# Altium schematic sheet 14 TPU.SchDoc
size A2; ApprovedBy: DNP; CheckedBy: DNP; Author: DNP; CompanyName: Google LLC; DrawnBy: DNP; Organization: Google LLC; Address1: 1600 Amphitheatre Parkway; Address2: Mountain View, CA 94043; Address3: DNP; Address4: DNP; DocumentNumber: 14; SheetNumber: 14; SheetTotal: 17; VersionControl_RevNumber: DNP; IsUserConfigurable: DNP; Time: DNP; ImagePath: DNP; Rule: DNP; ProjectName: Enterprise; Application_BuildNumber: DNP
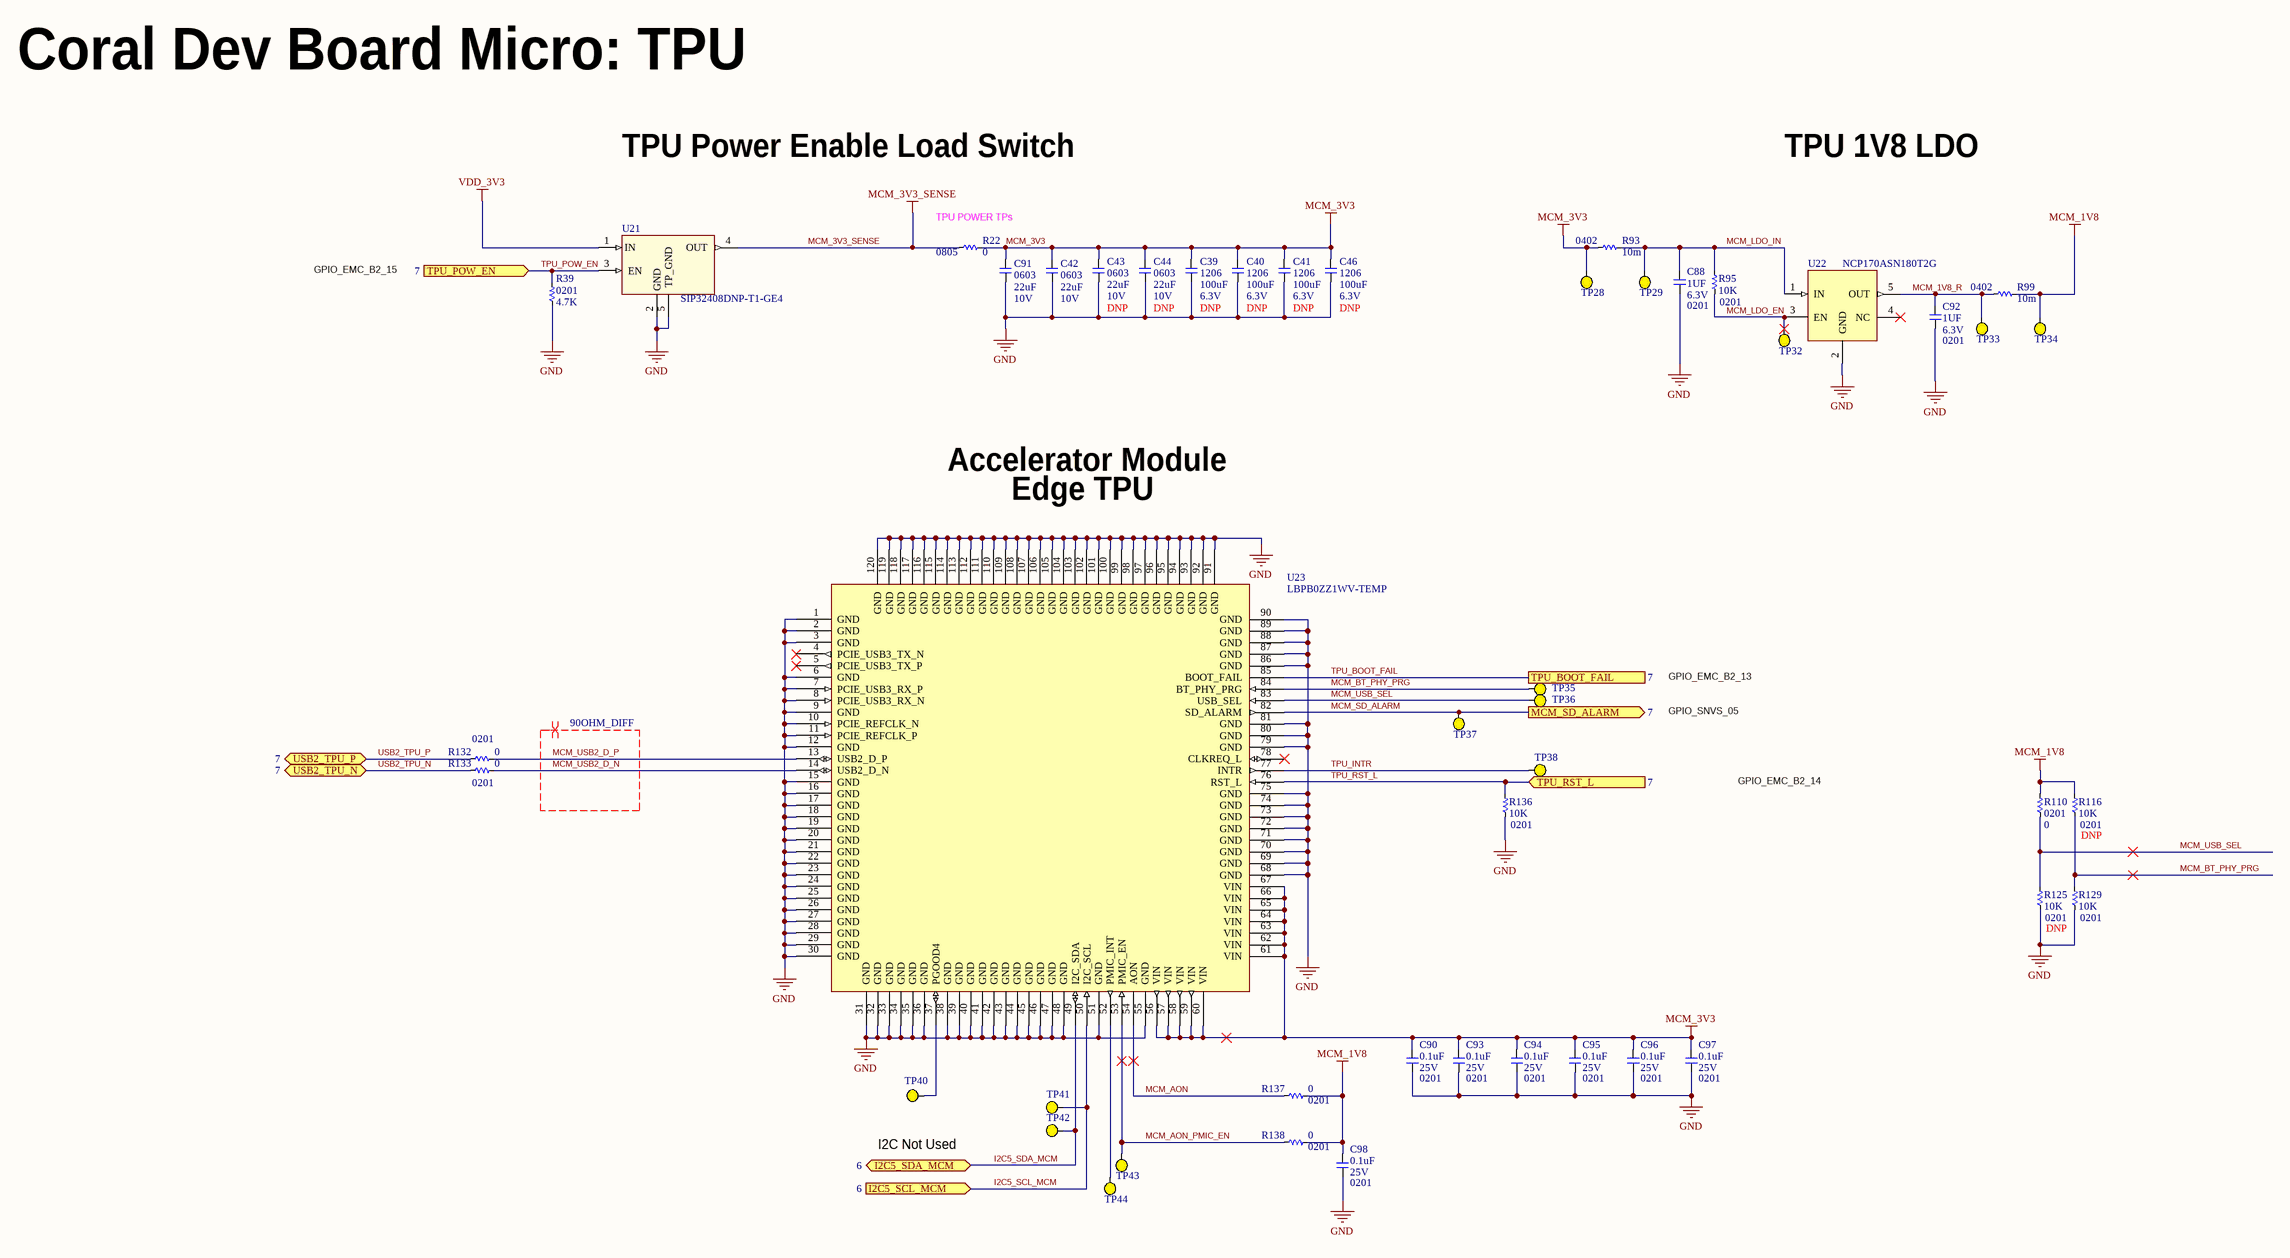
[diagram p0: 14 TPU.SchDoc]

## Parts
C39  value 100uF  Package: 1206  Voltage: 6.3V  [C1206Y_1.90MM]  (hidden comment: __Template_Cap)
C40  value 100uF  Package: 1206  Voltage: 6.3V  [C1206Y_1.90MM]  (hidden comment: __Template_Cap)
C41  value 100uF  Package: 1206  Voltage: 6.3V  [C1206Y_1.90MM]  (hidden comment: __Template_Cap)
C42  value 22uF  Package: 0603  Voltage: 10V  [C0603]  (hidden comment: __Template_Cap)
C43  value 22uF  Package: 0603  Voltage: 10V  [C0603]  (hidden comment: __Template_Cap)
C44  value 22uF  Package: 0603  Voltage: 10V  [C0603]  (hidden comment: __Template_Cap)
C46  value 100uF  Package: 1206  Voltage: 6.3V  [C1206Y_1.90MM]  (hidden comment: __Template_Cap)
C88  value 1UF  Package: 0201  Voltage: 6.3V  [C0201_H0.39MM]  (hidden comment: __Template_Cap)
C90  value 0.1uF  Package: 0201  Voltage: 25V  [C0201Y]  (hidden comment: __Template_Cap)
C91  value 22uF  Package: 0603  Voltage: 10V  [C0603]  (hidden comment: __Template_Cap)
C92  value 1UF  Package: 0201  Voltage: 6.3V  [C0201_H0.39MM]  (hidden comment: __Template_Cap)
C93  value 0.1uF  Package: 0201  Voltage: 25V  [C0201Y]  (hidden comment: __Template_Cap)
C94  value 0.1uF  Package: 0201  Voltage: 25V  [C0201Y]  (hidden comment: __Template_Cap)
C95  value 0.1uF  Package: 0201  Voltage: 25V  [C0201Y]  (hidden comment: __Template_Cap)
C96  value 0.1uF  Package: 0201  Voltage: 25V  [C0201Y]  (hidden comment: __Template_Cap)
C97  value 0.1uF  Package: 0201  Voltage: 25V  [C0201Y]  (hidden comment: __Template_Cap)
C98  value 0.1uF  Package: 0201  Voltage: 25V  [C0201Y]  (hidden comment: __Template_Cap)
R22  value 0  Package: 0805  [R0805]
R39  value 4.7K  Package: 0201  [R0201]
R93  value 10m  Package: 0402  [R0402]
R95  value 10K  Package: 0201  [R0201]
R99  value 10m  Package: 0402  [R0402]
R110  value 0  Package: 0201  [R0201]
R116  value 10K  Package: 0201  [R0201]
R125  value 10K  Package: 0201  [R0201]
R129  value 10K  Package: 0201  [R0201]
R132  value 0  Package: 0201  [R0201]
R133  value 0  Package: 0201  [R0201]
R136  value 10K  Package: 0201  [R0201]
R137  value 0  Package: 0201  [R0201]
R138  value 0  Package: 0201  [R0201]
TP28  TESTPAD_25MIL  [TESTPAD_SMT_25MIL]  (value not drawn)  (no BOM)
TP29  TESTPAD_25MIL  [TESTPAD_SMT_25MIL]  (value not drawn)  (no BOM)
TP32  TESTPAD_25MIL  [TESTPAD_SMT_25MIL]  (value not drawn)  (no BOM)
TP33  TESTPAD_25MIL  [TESTPAD_SMT_25MIL]  (value not drawn)  (no BOM)
TP34  TESTPAD_25MIL  [TESTPAD_SMT_25MIL]  (value not drawn)  (no BOM)
TP35  TESTPAD_25MIL  [TESTPAD_SMT_25MIL]  (value not drawn)  (no BOM)
TP36  TESTPAD_25MIL  [TESTPAD_SMT_25MIL]  (value not drawn)  (no BOM)
TP37  TESTPAD_25MIL  [TESTPAD_SMT_25MIL]  (value not drawn)  (no BOM)
TP38  TESTPAD_25MIL  [TESTPAD_SMT_25MIL]  (value not drawn)  (no BOM)
TP40  TESTPAD_25MIL  [TESTPAD_SMT_25MIL]  (value not drawn)  (no BOM)
TP41  TESTPAD_25MIL  [TESTPAD_SMT_25MIL]  (value not drawn)  (no BOM)
TP42  TESTPAD_25MIL  [TESTPAD_SMT_25MIL]  (value not drawn)  (no BOM)
TP43  TESTPAD_25MIL  [TESTPAD_SMT_25MIL]  (value not drawn)  (no BOM)
TP44  TESTPAD_25MIL  [TESTPAD_SMT_25MIL]  (value not drawn)  (no BOM)
U21  MFG P/N: SIP32408DNP-T1-GE4  [TDFN120X160X60-4-TP]  (hidden comment: SWITCH_SIP32408DNP-T1-GE4)
U22  MFG P/N: NCP170ASN180T2G  [TSOP95P275X110-5]  (hidden comment: LDO_NCP170ASN180T2G)
U23  LBPB0ZZ1WV-TEMP  [QFN120_0P5_10X15]

## Ports
I2C5_SCL_MCM (in, see 6), I2C5_SDA_MCM (bidir, see 6), MCM_SD_ALARM (out, see 7), TPU_BOOT_FAIL (see 7), TPU_POW_EN (in, see 7), TPU_RST_L (in, see 7), USB2_TPU_N (bidir, see 7), USB2_TPU_P (bidir, see 7)

## Nets
GND: C39.2 C40.2 C41.2 C42.2 C43.2 C44.2 C46.2 C88.2 C90.2 C91.2 C92.2 C93.2 C94.2 C95.2 C96.2 C97.2 C98.2 R39.1 R125.1 R129.1 R136.1 U21.2(GND) U21.5(TP_GND) U22.2(GND) U23.1(GND) U23.2(GND) U23.3(GND) U23.6(GND) U23.7(PCIE_USB3_RX_P) U23.8(PCIE_USB3_RX_N) U23.9(GND) U23.10(PCIE_REFCLK_N) U23.11(PCIE_REFCLK_P) U23.12(GND) U23.15(GND) U23.16(GND) U23.17(GND) U23.18(GND) U23.19(GND) U23.20(GND) U23.21(GND) U23.22(GND) U23.23(GND) U23.24(GND) U23.25(GND) U23.26(GND) U23.27(GND) U23.28(GND) U23.29(GND) U23.30(GND) U23.31(GND) U23.32(GND) U23.33(GND) U23.34(GND) U23.35(GND) U23.36(GND) U23.38(GND) U23.39(GND) U23.40(GND) U23.41(GND) U23.42(GND) U23.43(GND) U23.44(GND) U23.45(GND) U23.46(GND) U23.47(GND) U23.48(GND) U23.51(GND) U23.55(GND) U23.68(GND) U23.69(GND) U23.70(GND) U23.71(GND) U23.72(GND) U23.73(GND) U23.74(GND) U23.75(GND) U23.79(GND) U23.80(GND) U23.81(GND) U23.86(GND) U23.87(GND) U23.88(GND) U23.89(GND) U23.90(GND) U23.91(GND) U23.92(GND) U23.93(GND) U23.94(GND) U23.95(GND) U23.96(GND) U23.97(GND) U23.98(GND) U23.99(GND) U23.100(GND) U23.101(GND) U23.102(GND) U23.103(GND) U23.104(GND) U23.105(GND) U23.106(GND) U23.107(GND) U23.108(GND) U23.109(GND) U23.110(GND) U23.111(GND) U23.112(GND) U23.113(GND) U23.114(GND) U23.115(GND) U23.116(GND) U23.117(GND) U23.118(GND) U23.119(GND) U23.120(GND)
MCM_1V8: C98.1 R99.2 R110.2 R116.2 R137.2 R138.2 TP34.1
MCM_3V3: C39.1 C40.1 C41.1 C42.1 C43.1 C44.1 C46.1 C90.1 C91.1 C93.1 C94.1 C95.1 C96.1 C97.1 R22.2 R93.1 TP28.1 U23.56(VIN) U23.57(VIN) U23.58(VIN) U23.59(VIN) U23.60(VIN) U23.61(VIN) U23.62(VIN) U23.63(VIN) U23.64(VIN) U23.65(VIN) U23.66(VIN) U23.67(VIN)
MCM_3V3_SENSE: R22.1 U21.4(OUT)
VDD_3V3: U21.1(IN)
I2C5_SCL_MCM: TP41.1 U23.50(I2C_SCL) ; port I2C5_SCL_MCM
I2C5_SDA_MCM: TP42.1 U23.49(I2C_SDA) ; port I2C5_SDA_MCM
MCM_1V8_R: C92.1 R99.1 TP33.1 U22.5(OUT)
MCM_AON: R137.1 U23.54(AON)
MCM_AON_PMIC_EN: R138.1 TP43.1 U23.53(PMIC_EN)
MCM_BT_PHY_PRG: R116.1 R129.2 TP35.1 U23.84(BT_PHY_PRG)
MCM_LDO_EN: R95.1 TP32.1 U22.3(EN)
MCM_LDO_IN: C88.1 R93.2 R95.2 TP29.1 U22.1(IN)
MCM_SD_ALARM: TP37.1 U23.82(SD_ALARM) ; port MCM_SD_ALARM
MCM_USB2_D_N: R133.2 U23.14(USB2_D_N)
MCM_USB2_D_P: R132.2 U23.13(USB2_D_P)
MCM_USB_SEL: R110.1 R125.2 TP36.1 U23.83(USB_SEL)
TPU_BOOT_FAIL: U23.85(BOOT_FAIL) ; port TPU_BOOT_FAIL
TPU_INTR: TP38.1 U23.77(INTR)
TPU_POW_EN: R39.2 U21.3(EN) ; port TPU_POW_EN
TPU_RST_L: R136.2 U23.76(RST_L) ; port TPU_RST_L
USB2_TPU_N: R133.1 ; port USB2_TPU_N
USB2_TPU_P: R132.1 ; port USB2_TPU_P
NetTP40_1: TP40.1 U23.37(PGOOD4)
NetTP44_1: TP44.1 U23.52(PMIC_INT)

Not connected (* = marked no-connect by the designer): U22 4(NC)*; U23 4(PCIE_USB3_TX_N)* 5(PCIE_USB3_TX_P)* 78(CLKREQ_L)*

## Layout directives
differential pair; differential pair class 90OHM_DIFF: MCM_USB2_D_N, MCM_USB2_D_P

## Notes on the sheet
- Coral Dev Board Micro: TPU
- TPU Power Enable Load Switch
- TPU 1V8 LDO
- GPIO_EMC_B2_15
- (near R22) TPU POWER TPs
- Accelerator Module
- Edge TPU
- GPIO_EMC_B2_13
- GPIO_SNVS_05
- GPIO_EMC_B2_14
- (near TP40) I2C Not Used
- Project:
- Engineer:
- Date:
- File:
- Revision:
- Sheet
- of

## Library data of the parts
C39-C41 C46 = 1051: CAP, CER, X5R, 100UF, 6.3V, 20%, 1206; ID: 1051; MFG: MURATA; MFG P/N: GRM31CR60J107ME39L; XPN: 150-00520-00; PROXY: 150-04679-00; Status: Obsolete; Dielectric: X5R; Tolerance: 20%; Height: 1.9mm T; ComponentLink1Description: Datasheet; COMMON: 150-00520-00; DNP: DNP
C42 C91 = 108: CAP, CER, X5R, 22uF, 20%, 10V, 0603; ID: 108; MFG: TDK; MFG P/N: C1608X5R1A226M080AC; XPN: 150-00202-00; PROXY: Use ID #452; Status: Released; Dielectric: X5R; Tolerance: 20%; Height: 1mm; ComponentLink1Description: Datasheet; COMMON: 150-00202-00
C43 C44 = 392: CAP, CER, X5R, 22uF, 20%, 10V, 0603; ID: 392; MFG: SAMSUNG; MFG P/N: CL10A226MP8NUNE; XPN: 150-00202-00; PROXY: Use ID #452; Status: Released; Dielectric: X5R; Tolerance: 20%; Height: 0.9mm T; ComponentLink1Description: Datasheet; COMMON: 150-00202-00; DNP: DNP
C88 C92 = 1771: CAP, CER, X6S, 1uF, 20%, 6.3V, 0201, 0.39mm; ID: 1771; MFG: MURATA; MFG P/N: GRM033C80J105ME05D; EPIC: G150-02531-00; Status: In Development; Dielectric: X6S; Tolerance: 20%; Height: 0.39mm; Supplier 1: Digi-Key; HelpURL: https://www.digikey.com/product-detail/en/murata-electronics-north-america/GRM033C80J105ME05D/490-13218-1-ND/5877426; ComponentLink1Description: Datasheet; ComponentLink1URL: https://psearch.en.murata.com/capacitor/product/GRM033C80J105ME05%23.pdf; Supplier Part Number 1: 490-13218-1-ND
C90 C93-C98 = 386: CAP, CER, X5R, 0.1uF, 25V, 20%, 0201, 0.33mm T; ID: 386; MFG: MURATA; MFG P/N: GRM033R61E104ME14D; XPN: 150-01204-00; Status: Released; Dielectric: X5R; Tolerance: 20%; Height: 0.33mm T; ComponentLink1Description: Datasheet; COMMON: 150-01204-00; LOON: 150-01204-00; Gecko: 150-01204-00
R22 = 7564: RES, 0, JUMPER, 1/8W, 0805; ID: 7564; MFG: YAGEO; MFG P/N: RC0805JR-070RL; Tolerance: 5%; COMMON: 470-00435-00; Gecko: 470-17928-00; Status: Released; Power: 1/8W; LOON: 470-00435-00; XPN: 470-00435-00
R39 = 6602: RES, 4.7K, 5%, 1/20W, 0201; ID: 6602; MFG: YAGEO; MFG P/N: RC0201JR-074K7L; COMMON: 470-00012-00; Status: Released; Power: 1/20W; Tolerance: 5%; LOON: 470-00012-00; Gecko: 470-00012-00; XPN: 470-00012-00
R93 R99 = 7159: RES, 0.01, 5%, 1/4W, 0402; ID: 7159; MFG: YAGEO; MFG P/N: PE0402JRF470R01L; COMMON: 470-02385-00; Status: Released; Power: 1/4W; Tolerance: 5%; LOON: 470-02385-00; Gecko: 470-02385-00; XPN: 470-02385-00
R95 R116 R125 R129 R136 = 4151: RES, 10K, 1%, 1/20W, 0201; ID: 4151; MFG: YAGEO; MFG P/N: RC0201FR-0710KL; COMMON: 470-00033-00; PROXY: 470-16076-00; Status: Released; Power: 1/20W; Tolerance: 1%; Height: 0.26mm; Supplier 1: Digi-Key; LOON: 470-00033-00; Gecko: 470-00033-00; XPN: 470-00033-00; Supplier Part Number 1: 311-10.0KMCT-ND
  R116 R125: DNP: DNP
R110 R132 R133 R137 R138 = 8315: RES, 0.0, 1/20W, 0201; ID: 8315; MFG: PANASONIC; MFG P/N: ERJ1GN0R00C; Tolerance: JUMPER; COMMON: 470-00013-00; PROXY: Use ID #6940; Status: Released; Power: 1/20W; LOON: 470-00013-00; Gecko: 470-00013-00; XPN: 470-00013-00
TP28 TP29 TP32-TP38 TP40-TP44 = 115: TESTPAD_SMT_25MIL; ID: 115; MFG: _PCB Feature; Status: In Development; ComponentLink1URL: _PCB Feature
U21 = 926: IC, SW, SIP32408, HIGH-SIDE, N-CH, 1:1, 1.1V TO 5.5V VCL, 3.5A, 44mOHM RDS(ON), TDFN-4; ID: 926; MFG: Vishay Siliconix; Status: Released; Package: 4-TDFN (1.2x1.6); Category: Integrated Circuits (ICs); RoHS Compliant: Yes; Supplier 1: Digi-Key; HelpURL: https://www.digikey.com/en/products/detail/vishay-siliconix/SIP32408DNP-T1-GE4/4496331?s=N4IgTCBcDaIAQGUCSAFAzGALABgBwBEA5FAWgBUBGEgcQFFMQBdAXyA; ComponentLink1Description: Datasheet; ComponentLink1URL: https://www.vishay.com/docs/63717/sip32408.pdf; Mounting Type: SMD; Height: 0.6mm; Supplier Part Number 1: SIP32408DNP-T1-GE4TR-ND
U22 = 930: IC, REG, NCP170AS, LINEAR, FIXED, 2.2V TO 5.5V VIN, 1.8V VOUT, 150mA, TSOP-5; ID: 930; MFG: onsemi; Status: Released; Package: 5-TSOP; Category: Integrated Circuits (ICs); RoHS Compliant: Yes; Supplier 1: Digi-Key; HelpURL: https://www.digikey.com/en/products/detail/onsemi/NCP170ASN180T2G/9829222?s=N4IgTCBcDaIHIGEAKBGA7ABgIIGU4oA4MAVMAcRAF0BfIA; ComponentLink1Description: Datasheet; ComponentLink1URL: https://www.onsemi.com/pdf/datasheet/ncp170-d.pdf; Mounting Type: SMD; Height: 1.1mm; Supplier Part Number 1: NCP170ASN180T2GOSTR-ND
U23 = LBPB0ZZ1WV-TEMP: TPU module